# EAGLE design Main (EAGLE 9.6.2)
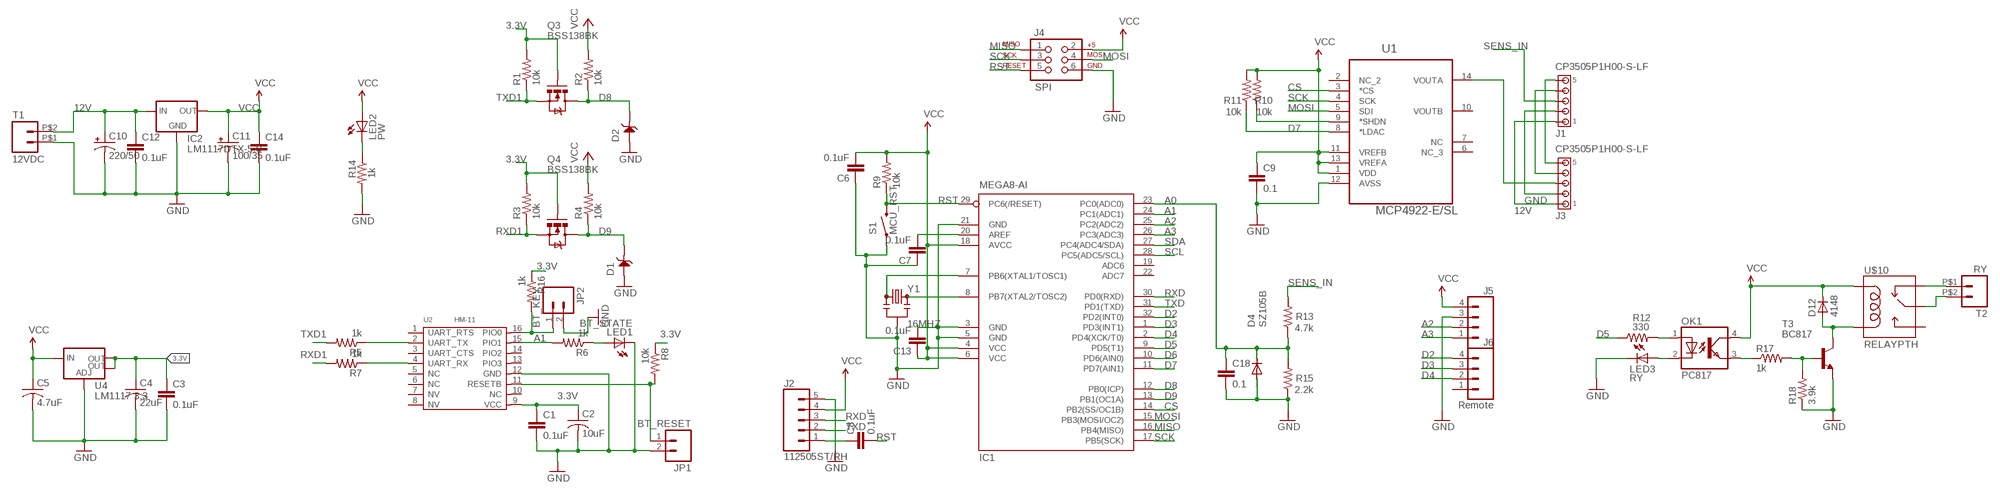
[diagram p0: schematic, sheet 1]

## Parts
C1  0.1uF  CAP0805  [0805]
C2  10uF  C-USC1206  [C1206]
C3  0.1uF  CAP0805  [0805]
C4  22uF  C-USC1206  [C1206]
C5  4.7uF  C-USC1206  [C1206]
C6  0.1uF  CAP0805  [0805]
C7  0.1uF  CAP0805  [0805]
C8  0.1uF  CAP0805  [0805]
C9  0.1  CAP0805  [0805]
C10  220/50  CPOL-US153CLV-1010  [153CLV-1010]
C11  100/35  CPOL-US153CLV-0605  [153CLV-0605]
C12  0.1uF  CAP0805  [0805]
C13  0.1uF  CAP0805  [0805]
C14  0.1uF  CAP0805  [0805]
C18  0.1  CAP0805  [0805]
D1  SMF5.0A  D-ESD-2P'CESD5V0D1'  [SOD123-2.7X1.6]
D2  SMF5.0A  D-ESD-2P'CESD5V0D1'  [SOD123-2.7X1.6]
D4  SZ105B  DIODE-DO-214AC  [DO-214AC]
D12  4148  D-SOD-80  [SOD80]
IC1  MEGA8-AI  [TQFP32-08]
IC2  LM1117DTX-5.0  LM1117DTX-3.3  [TO252]
J1  CP3505P1H00-S-LF  1445055-5  [1445055-5]
J2  112505ST/RH  CONN_05JST  [JST-5-PTH]
J3  CP3505P1H00-S-LF  1445055-5  [1445055-5]
J4  SPI  AVR_SPI_PRG_6PTH  [2X3]
J5  CONN_04JST-PTH  [JST-4-PTH]
J6  Remote  CONN_04JST-PTH  [JST-4-PTH]
JP1  BT_RESET  M02PTH  [1X02]
JP2  BT_KEY  M02PTH  [1X02]
LED1  BT_STATE  LED3MM  [LED3MM]
LED2  PW  LED3MM  [LED3MM]
LED3  RY  LED3MM  [LED3MM]
OK1  PC817  LTV816S  [DIL4-SMD]
Q3  BSS138BK  MOSFET-NCHANNELBSS138  [SOT23-3]
Q4  BSS138BK  MOSFET-NCHANNELBSS138  [SOT23-3]
R1  10k  RESISTOR0805-RES  [0805]
R2  10k  RESISTOR0805-RES  [0805]
R3  10k  RESISTOR0805-RES  [0805]
R4  10k  RESISTOR0805-RES  [0805]
R5  1k  RESISTOR0805-RES  [0805]
R6  1k  RESISTOR0805-RES  [0805]
R7  1k  RESISTOR0805-RES  [0805]
R8  10k  RESISTOR0805-RES  [0805]
R9  10k  RESISTOR0805-RES  [0805]
R10  10k  RESISTOR0805-RES  [0805]
R11  10k  RESISTOR0805-RES  [0805]
R12  330  RESISTOR0805-RES  [0805]
R13  4.7k  RESISTOR0805-RES  [0805]
R14  1k  RESISTOR0805-RES  [0805]
R15  2.2k  RESISTOR0805-RES  [0805]
R16  1k  RESISTOR0805-RES  [0805]
R17  1k  RESISTOR0805-RES  [0805]
R18  3.9k  RESISTOR0805-RES  [0805]
S1  MCU_RST  SWITCH-MOMENTARY-2SMD-1101NE  [TACTILE-SWITCH-1101NE]
T1  12VDC  ST02-3.5MM  [ED350V-02P]
T2  RY  ST02-3.5MM  [ED350V-02P]
T3  BC817  BC817-16-NPN-SOT23-BEC  [SOT23-BEC]
U1  MCP4922-E/SL  [SOIC127P600X175-14N]
U2  HM-11  [16P-18.5X13.5X0.8]
U4  LM1117 3.3  V_REG_LM1117SOT223  [SOT223]
U$10  RELAYPTH  [SRD-05VDC-SL-C]
Y1  16MHZ  RESONATOR16MHZ  [RESONATOR-SMD]

## Nets
3.3V: C1.1 C2.1 C3.1 C4.1 Q3.1(G) Q4.1(G) R1.2 R3.2 R8.1 R16.1 U2.9(VCC) U4.2(OUT) U4.4(OUT)
12V: C10.+ C12.1 IC2.2(IN) J1.1 J3.1 T1.P$2
A0: C18.1 D4.C IC1.23(PC0(ADC0)) R13.1 R15.2
A1: IC1.24(PC1(ADC1)) R6.2 U2.15(PIO1)
A2: IC1.25(PC2(ADC2)) J5.2
A3: IC1.26(PC3(ADC3)) J5.1
CS: IC1.14(PB2(SS/OC1B)) U1.3(*CS)
D2: IC1.32(PD2(INT0)) J6.4
D3: IC1.1(PD3(INT1)) J6.3
D4: IC1.2(PD4(XCK/T0)) J6.2
D5: IC1.9(PD5(T1)) R12.1
D6: IC1.10(PD6(AIN0))
D7: IC1.11(PD7(AIN1)) R11.1 U1.8(*LDAC)
D8: D2.2 IC1.12(PB0(ICP)) Q3.3(D) R2.1
D9: D1.2 IC1.13(PB1(OC1A)) Q4.3(D) R4.1
GND: C1.2 C2.2 C3.2 C4.2 C5.2 C6.1 C7.1 C9.2 C10.- C11.- C12.2 C13.2 C14.2 C18.2 D1.1 D2.1 D4.A IC1.3(GND) IC1.5(GND) IC1.21(GND) IC2.1(GND) J1.2 J2.5 J3.2 J4.6 J5.3 JP1.2 JP2.2 LED1.K(C) LED3.K(C) R14.2 R15.1 R18.1 S1.1 T1.P$1 T3.E U1.12(AVSS) U2.12(GND) U4.1(ADJ) Y1.2
MISO: IC1.16(PB4(MISO)) J4.1
MOSI: IC1.15(PB3(MOSI/OC2)) J4.4 U1.5(SDI)
N$1: LED1.A R6.1
N$2: JP2.1 R16.2 U2.16(PIO0)
N$3: R5.1 U2.2(UART_TX)
N$4: JP1.1 R8.2 U2.11(RESETB)
N$5: IC1.8(PB7(XTAL2/TOSC2)) Y1.3
N$6: R7.1 U2.4(UART_RX)
N$7: IC1.7(PB6(XTAL1/TOSC1)) Y1.1
N$8: C7.2 IC1.20(AREF)
N$9: C8.1 J2.1
N$12: LED2.K(C) R14.1
N$13: J3.3 U1.14(VOUTA)
N$14: J1.5 J3.5
N$15: J1.4 J3.4
N$16: R10.1 U1.9(*SHDN)
N$20: OK1.3(EMIT) R17.1
N$21: R17.2 R18.2 T3.B
N$22: D12.2(A) T3.C U$10.COIL0
N$23: OK1.1(A) R12.2
N$24: T2.P$1 U$10.SWCLOSED(SWCLOSE)
N$25: T2.P$2 U$10.SWCOMMON
N$31: LED3.A OK1.2(C)
RST: C8.2 IC1.29(PC6(/RESET)) J4.5 R9.1 S1.2
RXD: IC1.30(PD0(RXD)) J2.3
RXD1: Q4.2(S) R3.1 R7.2
SCK: IC1.17(PB5(SCK)) J4.3 U1.4(SCK)
SCL: IC1.28(PC5(ADC5/SCL))
SDA: IC1.27(PC4(ADC4/SDA))
SENS_IN: J1.3 R13.2
TXD: IC1.31(PD1(TXD)) J2.2
TXD1: Q3.2(S) R1.1 R5.2
VCC: C5.1 C6.2 C9.1 C11.+ C13.1 C14.1 D12.1(C) IC1.4(VCC) IC1.6(VCC) IC1.18(AVCC) IC2.TAB(OUT) J2.4 J4.2 J5.4 LED2.A OK1.4(COL) R2.2 R4.2 R9.2 R10.2 R11.2 U1.1(VDD) U1.11(VREFB) U1.13(VREFA) U4.3(IN) U$10.COIL1
Unconnected: IC1.19(ADC6) IC1.22(ADC7) J6.1 U1.2(NC_2) U1.6(NC_3) U1.7(NC) U1.10(VOUTB) U2.1(UART_RTS) U2.3(UART_CTS) U2.5(NC) U2.6(NC) U2.7(NV) U2.8(NV) U2.10(NC) U2.13(PIO3) U2.14(PIO2) U$10.SWOPEN

## Library data of the parts
C1 = SparkFun-Capacitors:CAP: Capacitor Standard 0603 ceramic capacitor, and 0.1" leaded capacitor.
C2 C4 C5 = adafruit:C-US: CAPACITOR, American symbol
C3 C6-C9 C12-C14 C18 = SparkFun-Passives:CAP: Capacitor Standard 0603 ceramic capacitor, and 0.1" leaded capacitor.
C10 C11 = adafruit:CPOL-US: POLARIZED CAPACITOR, American symbol
D1 D2 = discrete:D-ESD-2P: Diodes for Protectiong against ESD
D4 = diode:DIODE-: DIODE
D12 = semicon-smd-ipc:D-: DIODE unfilled
IC1 = atmel:MEGA8: MICROCONTROLLER 8 Kbytes FLASH, 1 kbytes SRAM, 512 bytes EEPROM, USART, 6-channel 10 bit ADC, 2-channel 8 bit ADC Pin compatible with Atmega48, ATMega88, ATMega168 Source: avr.lbr; MPN: ATMEGA8-16AU; OC_FARNELL: 9171371; OC_NEWARK: 73M8863
IC2 = lm1117:LM1117DTX-*
J1 J3 = con-amp:1445055-5: Micro MATE-N-LOK Connectors grid 1.5 mm Source: ENG_CD_1445055_A.pdf
J2 = SparkFun-Connectors:CONN_05: Multi connection point. Often used as Generic Header-pin footprint for 0.1 inch spaced/style header connections On any of the 0.1 inch spaced packages, you can populate with these: Break Away Headers - Straight <https://www.sparkfun.com/products/116> (PRT-00116) Break Away Male Headers - Right Angle <https://www.sparkfun.com/products/553> (PRT-00553) Female Headers <https://www.sparkfun.com/products/115> (PRT-00115) Break Away Headers - Machine Pin <https://www.sparkfun.com/products/117> (PRT-00117) Break Away Female Headers - Swiss Machine Pin <https://www.sparkfun.com/products/743> (PRT-00743) For SCREWTERMINALS and SPRING TERMINALS visit here: Screw Terimnals on SparkFun.com <https://www.sparkfun.com/search/results?term=Screw+Terminals> (5mm/3.5mm/2.54mm spacing) This device is also useful as a general connection point to wire up your design to another part of your project. Our various solder wires solder well into these plated through hole pads. Hook-Up Wire - Assortment (Stranded, 22 AWG) <https://www.sparkfun.com/products/11375> (PRT-11375) Hook-Up Wire - Assortment (Solid Core, 22 AWG) <https://www.sparkfun.com/products/11367> (PRT-11367) View the entire wire category on our website here <https://www.sparkfun.com/categories/141> Special notes: Molex polarized connector foot print use with SKU : PRT-08231 with associated crimp pins and housings. 1MM SMD Version SKU: PRT-10208; SF_ID: PRT-09917
J4 = SparkFun-Connectors:AVR_SPI_PRG_6: AVR ISP 6 Pin This is the reduced ISP connector for AVR programming. Common on Arduino. This footprint will take up less PCB space and can be used with a 10-pin to 6-pin adapter such as SKU: BOB-08508 **Special note about "TEST_POINT" package. The stop mask is on the top side, so if you want your programming test points to be on the bottom of your board, make sure to place this package on the bottom side of the board. This also ensure that the orientation to program from the bottom side will be correct.
J5 J6 = SparkFun-Connectors:CONN_04: Multi connection point. Often used as Generic Header-pin footprint for 0.1 inch spaced/style header connections On any of the 0.1 inch spaced packages, you can populate with these: Break Away Headers - Straight <https://www.sparkfun.com/products/116> (PRT-00116) Break Away Male Headers - Right Angle <https://www.sparkfun.com/products/553> (PRT-00553) Female Headers <https://www.sparkfun.com/products/115> (PRT-00115) Break Away Headers - Machine Pin <https://www.sparkfun.com/products/117> (PRT-00117) Break Away Female Headers - Swiss Machine Pin <https://www.sparkfun.com/products/743> (PRT-00743) For SCREWTERMINALS and SPRING TERMINALS visit here: Screw Terimnals on SparkFun.com <https://www.sparkfun.com/search/results?term=Screw+Terminals> (5mm/3.5mm/2.54mm spacing) This device is also useful as a general connection point to wire up your design to another part of your project. Our various solder wires solder well into these plated through hole pads. Hook-Up Wire - Assortment (Stranded, 22 AWG) <https://www.sparkfun.com/products/11375> (PRT-11375) Hook-Up Wire - Assortment (Solid Core, 22 AWG) <https://www.sparkfun.com/products/11367> (PRT-11367) View the entire wire category on our website here <https://www.sparkfun.com/categories/141> Special notes: Molex polarized connector foot print use with SKU : PRT-08231 with associated crimp pins and housings. 1MM SMD Version SKU: PRT-10208; PROD_ID: WIRE-13531; SF_ID: PRT-09916
JP1 JP2 = SparkFun:M02: Header 2 Standard 2-pin 0.1" header. Use with straight break away headers (SKU : PRT-00116), right angle break away headers (PRT-00553), swiss pins (PRT-00743), machine pins (PRT-00117), and female headers (PRT-00115). Molex polarized connector foot print use with SKU : PRT-08233 with associated crimp pins and housings.
LED1-LED3 = adafruit:LED: LED OSRAM: - CHIPLED LG R971, LG N971, LY N971, LG Q971, LY Q971, LO R971, LY R971 LH N974, LH R974 LS Q976, LO Q976, LY Q976 LO Q996 - Hyper CHIPLED LW Q18S LB Q993, LB Q99A, LB R99A - SideLED LS A670, LO A670, LY A670, LG A670, LP A670 LB A673, LV A673, LT A673, LW A673 LH A674 LY A675 LS A676, LA A676, LO A676, LY A676, LW A676 LS A679, LY A679, LG A679 - Hyper Micro SIDELED® LS Y876, LA Y876, LO Y876, LY Y876 LT Y87S - SmartLED LW L88C, LW L88S LB L89C, LB L89S, LG L890 LS L89K, LO L89K, LY L89K LS L896, LA L896, LO L896, LY L896 - TOPLED LS T670, LO T670, LY T670, LG T670, LP T670 LSG T670, LSP T670, LSY T670, LOP T670, LYG T670 LG T671, LOG T671, LSG T671 LB T673, LV T673, LT T673, LW T673 LH T674 LS T676, LA T676, LO T676, LY T676, LB T676, LH T676, LSB T676, LW T676 LB T67C, LV T67C, LT T67C, LS T67K, LO T67K, LY T67K, LW E67C LS E67B, LA E67B, LO E67B, LY E67B, LB E67C, LV E67C, LT E67C LW T67C LS T679, LY T679, LG T679 LS T770, LO T770, LY T770, LG T770, LP T770 LB T773, LV T773, LT T773, LW T773 LH T774 LS E675, LA E675, LY E675, LS T675 LS T776, LA T776, LO T776, LY T776, LB T776 LHGB T686 LT T68C, LB T68C - Hyper Mini TOPLED® LB M676 - Mini TOPLED Santana® LG M470 LS M47K, LO M47K, LY M47K Source: http://www.osram.convergy.de/
OK1 = optocoupler:LTV816: OPTO COUPLER Source: LITEON, LTV816.pdf
Q3 Q4 = SparkFun-DiscreteSemi:MOSFET-NCHANNEL: Common NMOSFET Parts MFG P/N Store ID Prod ID FDD8780 TRANS-09984 SI7820DN TRANS-11055 FDS6630A IC-08089 2N7002PW TRANS-11151 FQP30N06L COM-10213 TRANS-10060 BSS123LT1G TRANS-08345 BSS138 TRANS-00830 BS170 2N7000; PROD_ID: TRANS-00830; VALUE: 200mA/50V
R1-R11 R13-R16 = SparkFun-Resistors:RESISTOR: Resistor Basic schematic elements and footprints for 0603, 1206, and PTH resistors.
R12 R17 R18 = SparkFun-Passives:RESISTOR: Resistor Basic schematic elements and footprints for 0603, 1206, and PTH resistors.
S1 = SparkFun-Electromechanical:SWITCH-MOMENTARY-2: Various NO switches- pushbuttons, reed, etc; PROD_ID: SWCH-00815
T1 T2 = con-dinkle:ST02: Dinkle® Screw Terminal Block - 2 Way -5MM: EK500V series. Rated at 20A, 300VAC. Cable size: 2mm² Supplier: Altronics P2034A Source: http://www.dinkle.com/upfiles/proter21253708953.pdf -5.08MM: The back half of a EK500V4R-04P. Rated at 20A, 300VAC. Cable size: 2mm² Supplier: Altronics P2024 (half of) Source: http://www.dinkle.com/upfiles/proter21253708833.pdf -3.5MM: ED350V series. Rated at 10A, 300VAC. Cable size: 1.4mm² Supplier: Altronics P2028 Source: http://www.dinkle.com/upfiles/proter21253714491.pdf
T3 = transistor:*-NPN-: NPN Transistror BF959 corrected 2008.03.06
U1 = Microchip_By_element14_Batch_1:MCP4922-E/SL: IC, 12BIT DAC DUAL, SPI I/F; MPN: MCP4922-E/SL; OC_FARNELL: 1332114; OC_NEWARK: 08J8748; PACKAGE: SOIC14; SUPPLIER: Microchip
U2 = template:HM-11: Bluetooth Specification V4.0 BLE
U4 = SparkFun-PowerIC:V_REG_LM1117: Voltage Regulator LM1117 Standard adjustable voltage regulator but in SMD form. Spark Fun Electronics SKU : COM-00595; PROD_ID: VREG-08170
U$10 = SRD-05VDC-SL-C:RELAY: SPDT relay (COM-00101)
Y1 = SparkFun-FreqCtrl:RESONATOR: Resonator Small SMD resonator. Used, eg, on the Arduino Pro/ Pro Mini boards. 8MHz- XTAL-08895 16MHz- XTAL-08900; PROD_ID: XTAL-08900

## Net classes
1 power: width 0.203 mm

## Board
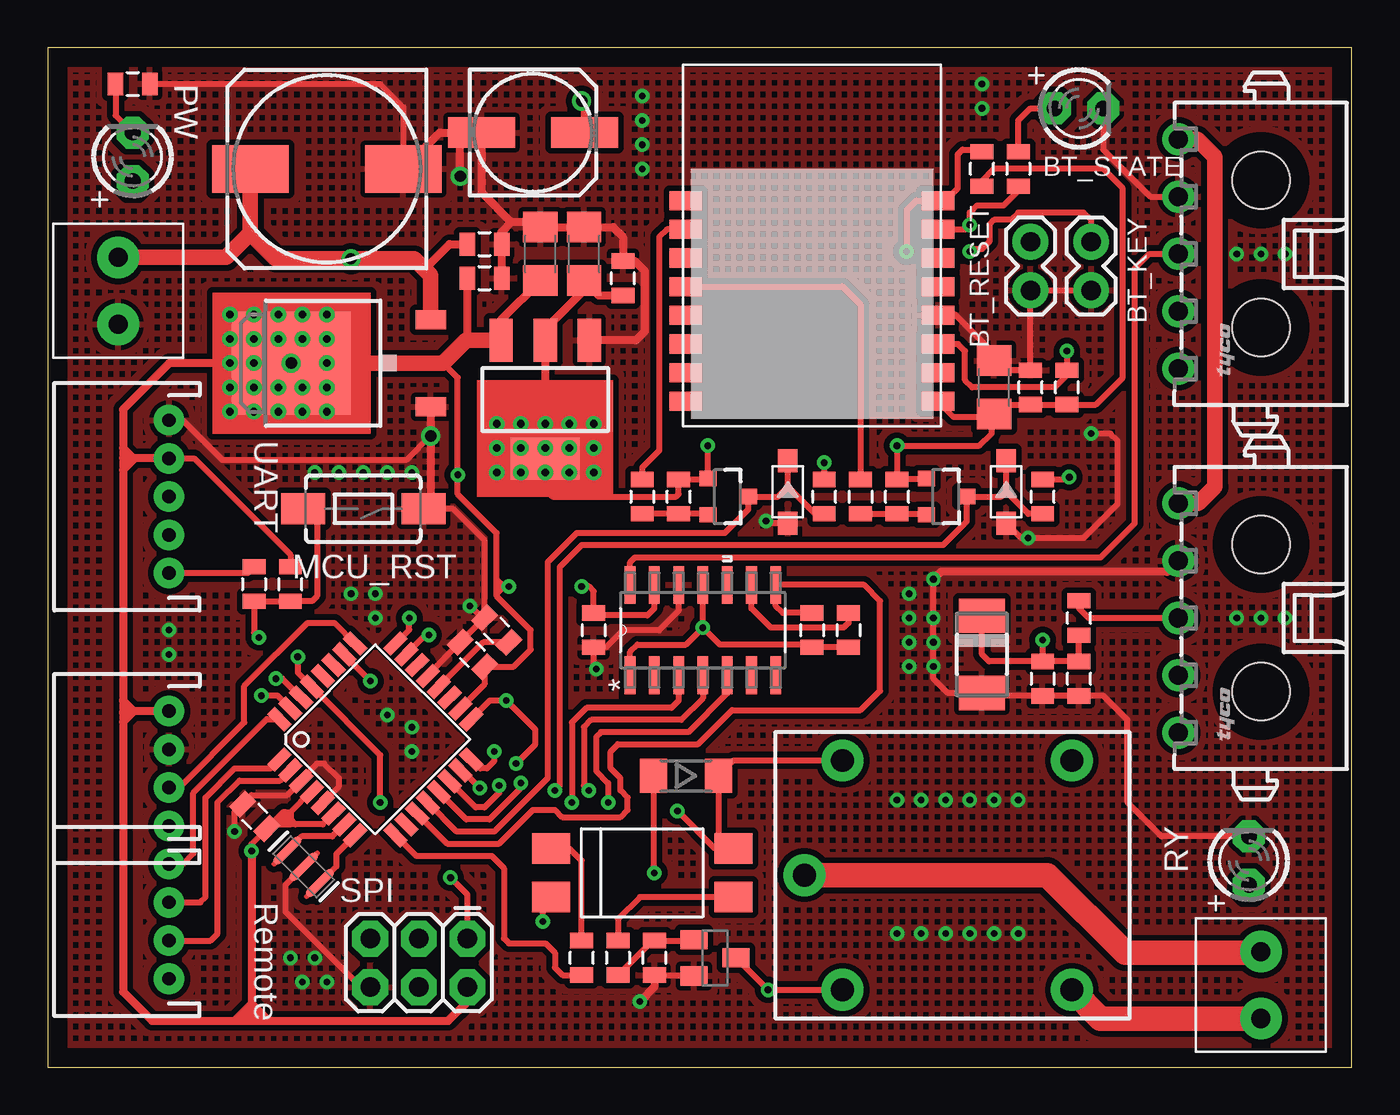
[diagram p1: board, top side]
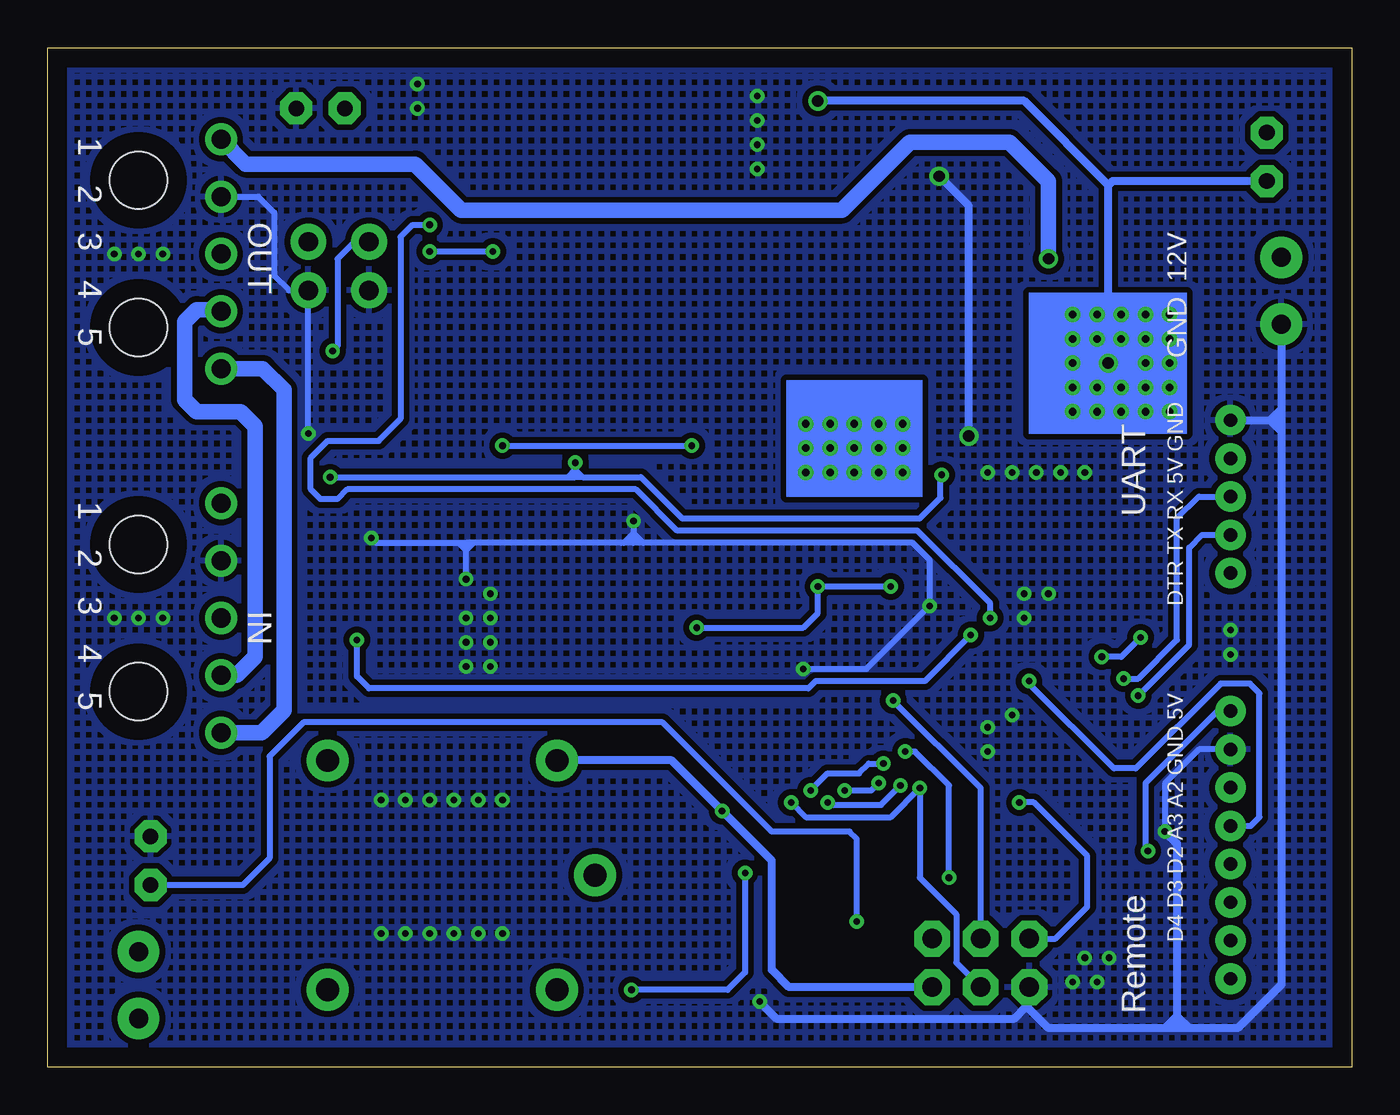
[diagram p2: board, bottom side, seen from below]

Size 68.25 x 53.33 mm. Coordinates in mm from the lower left corner, seen from the top.
Outline: 0,0 68.25,0 68.25,53.33 0,53.33 0,0
Copper layers (1*16): Top 0.035mm / dielectric 1.5mm / Bottom 0.035mm
Design rules "default *": minimum track width 6mil, minimum drill 0.35mm, track to track 6mil, track to pad 6mil, pad to pad 6mil, via to via 6mil, smd to smd 6mil, copper to edge 40mil, drill to drill 6mil, minimum pad ring 10mil, minimum via ring 8mil, stop-mask expansion 4mil, vias tented up to drill 25mil, thermal gap 10mil

### Footprints (pad centres in the part's own frame; a part is rotated, then mirrored left to right if it is on the bottom)
0805 = smd 0.8 x 1.2: 1 -0.9,0; 2 0.9,0
C1206 = smd 1.6 x 1.8: 1 -1.4,0; 2 1.4,0
153CLV-1010 = smd 4 x 2.5: + 4,0; - -4,0
153CLV-0605 = smd 3.5 x 1.6: + 2.7,0; - -2.7,0
SOD123-2.7X1.6 = smd 1.2 x 1.02: 1 -1.635,0; 2 1.635,0
DO-214AC = smd 1.8 x 2.4: A 2.025,0; C -2.025,0
SOD80 = smd 1.4 x 1.8: 1 -1.7,0; 2 1.7,0
TQFP32-08 = smd 1.27 x 0.559: 1 -4.293,2.8; 2 -4.293,2; 3 -4.293,1.2; 4 -4.293,0.4; 5 -4.293,-0.4; 6 -4.293,-1.2; 7 -4.293,-2; 8 -4.293,-2.8; 17 4.293,-2.8; 18 4.293,-2; 19 4.293,-1.2; 20 4.293,-0.4; 21 4.293,0.4; 22 4.293,1.2; 23 4.293,2; 24 4.293,2.8 | smd 0.559 x 1.27: 9 -2.8,-4.293; 10 -2,-4.293; 11 -1.2,-4.293; 12 -0.4,-4.293; 13 0.4,-4.293; 14 1.2,-4.293; 15 2,-4.293; 16 2.8,-4.293; 25 2.8,4.293; 26 2,4.293; 27 1.2,4.293; 28 0.4,4.293; 29 -0.4,4.293; 30 -1.2,4.293; 31 -2,4.293; 32 -2.8,4.293
TO252 = smd 1 x 1.6: 1 -2.28,-4.8; 2 2.28,-4.8 | smd 5.4 x 6.2: TAB 0,2.5
1445055-5 = drill 1 pad 1.676: 1 6,4.32; 2 3,4.32; 3 0,4.32; 4 -3,4.32; 5 -6,4.32 | hole 3: -3.85,0; 3.85,0
JST-5-PTH = drill 0.7 pad 1.6: 1 -4,0; 2 -2,0; 3 0,0; 4 2,0; 5 4,0
2X3 = drill 1.016 pad 1.88 octagon: 1 0,0; 2 0,2.54; 3 2.54,0; 4 2.54,2.54; 5 5.08,0; 6 5.08,2.54
JST-4-PTH = drill 0.7 pad 1.6: 1 -3,0; 2 -1,0; 3 1,0; 4 3,0
1X02 = drill 1.016 pad 1.88: 1 0,0; 2 2.54,0
LED3MM = drill 0.813 pad 1.676 octagon: A -1.27,0; K 1.27,0
DIL4-SMD = smd 1.6 x 2: 1 -1.27,-4.77; 2 1.27,-4.77; 3 1.27,4.77; 4 -1.27,4.77
SOT23-3 = smd 0.8 x 0.9: 1 -0.95,-1; 2 0.95,-1; 3 0,1.1
TACTILE-SWITCH-1101NE = smd 2.3 x 1.6: 1 -3.15,0; 2 3.15,0
ED350V-02P = drill 1 pad 2.184: P$1 0,0; P$2 3.5,0
SOT23-BEC = smd 1 x 1.4: B -0.95,-1.1; C 0,1.1; E 0.95,-1.1
SOIC127P600X175-14N = smd 1.981 x 0.559: 1 -2.362,3.81; 2 -2.362,2.54; 3 -2.362,1.27; 4 -2.362,0; 5 -2.362,-1.27; 6 -2.362,-2.54; 7 -2.362,-3.81; 8 2.362,-3.81; 9 2.362,-2.54; 10 2.362,-1.27; 11 2.362,0; 12 2.362,1.27; 13 2.362,2.54; 14 2.362,3.81
16P-18.5X13.5X0.8 = smd 1.7 x 1: 1 -6.6,2.15; 2 -6.6,0.65; 3 -6.6,-0.85; 4 -6.6,-2.35; 5 -6.6,-3.85; 6 -6.6,-5.35; 7 -6.6,-6.85; 8 -6.6,-8.35; 9 6.6,-8.35; 10 6.6,-6.85; 11 6.6,-5.35; 12 6.6,-3.85; 13 6.6,-2.35; 14 6.6,-0.85; 15 6.6,0.65; 16 6.6,2.15
SOT223 = smd 1.219 x 2.235: 1 -2.311,-3.099; 2 0,-3.099; 3 2.311,-3.099 | smd 3.6 x 2.2: 4 0,3.099
SRD-05VDC-SL-C = drill 1.2 pad 2.184: COIL0 -5.39,-6.12; COIL1 -5.39,5.88; SWCLOSED 6.61,-6.12; SWCOMMON -7.39,-0.12; SWOPEN 6.61,5.88
RESONATOR-SMD = smd 0.45 x 1.905: 1 -1.2,0; 2 0,0; 3 1.2,0

### Placement (x,y rotation side)
C1  51.43,35.56 90 top
C2  49.53,35.56 90 top
C3  30.1,41.27 90 top
C4  28.07,42.55 90 top
C5  25.78,42.55 90 top
C6  22.23,21.59 315 top
C7  23.5,22.86 315 top
C8  10.79,25.27 270 top
C9  28.57,22.86 270 top
C10  14.61,46.99 180 top
C11  25.4,48.9 0 top
C12  22.86,43.05 0 top
C13  10.83,13.12 135 top
C14  22.86,41.27 0 top
C18  52.07,20.32 270 top
D1  50.16,30.1 90 top
D2  38.73,30.1 90 top
D4  48.89,21.59 270 top
D12  33.4,15.24 180 top
IC1  17.14,17.14 45 top
IC2  15.24,36.83 90 top
J1  63.5,23.5 90 top
J2  6.35,29.84 90 top
J3  63.5,42.55 90 top
J4  21.96,6.72 180 top
J5  6.35,15.62 90 top
J6  6.35,7.62 90 top
JP1  51.43,43.18 270 top
JP2  54.61,43.18 270 top
LED1  53.97,50.16 0 top
LED2  4.45,47.62 90 top
LED3  62.87,10.79 90 top
OK1  31.11,10.16 270 top
Q3  35.56,29.84 270 top
Q4  46.99,29.84 270 top
R1  33.02,29.84 90 top
R2  40.64,29.84 90 top
R3  44.45,29.84 90 top
R4  52.07,29.84 90 top
R5  31.11,29.84 270 top
R6  50.8,46.99 270 top
R7  42.54,29.84 270 top
R8  53.34,35.56 90 top
R9  12.7,25.27 90 top
R10  41.91,22.86 270 top
R11  40,22.86 270 top
R12  27.94,5.71 90 top
R13  53.97,23.5 90 top
R14  4.45,51.44 0 top
R15  53.97,20.32 90 top
R16  48.89,46.99 90 top
R17  29.84,5.71 270 top
R18  31.75,5.71 90 top
S1  16.51,29.21 180 top
T1  3.68,38.86 90 top
T2  63.5,2.54 90 top
T3  34.92,5.71 270 top
U1  34.29,22.86 90 top
U2  40,43.18 0 top
U4  26.04,34.92 180 top
U$10  46.99,10.16 0 top
Y1  13.39,10.48 315 top

### Tracks (layer width: path | path; a pad name or v marks a point on that pad's centre or on a via)
3.3V  (via drill 0.35, 0.4)
  Top 0.305: Q4.1 45.94,30.75 R3.2 v44.45,32.51 48.77,32.51 49.4,33.15 49.4,34.02 | U2.9 47.41,34.02 49.4,34.02 | 49.4,34.02 49.66,34.02 C2.1 50.03,34.66 C1.1 R8.1 54.85,34.66 56.26,36.07 56.26,45.97 55.24,46.99 49.53,46.99 48.89,46.35 R16.1 | v34.54,32.51 34.56,32.5 Q3.1 34.51,30.75 R1.2 33.02,29.97 32.89,29.84 26.42,29.84 26.04,30.23 v26.04,31.11 U4.4 | v23.5,33.66 v24.77,33.66 25.4,33.66 26.04,34.29 26.67,33.66 v27.3,33.66 | v27.3,33.66 v28.57,33.66 v28.57,32.38 v27.3,32.38 26.59,32.38 U4.4 | U4.4 25.48,32.38 v24.77,32.38 v23.5,32.38 v23.5,31.11 v24.77,31.11 25.32,31.11 U4.4 | v28.57,31.11 v27.3,31.11 26.75,31.11 26.71,31.15 U4.4 | v26.04,33.66 v27.3,33.66
  Top 0.406: C3.1 28.84,40.38 C4.1 28.07,40.64 26.04,38.61 U4.2 26.04,34.29 v26.04,33.66 v26.04,32.38 U4.4
  Bottom 0.305: v44.45,32.51 v34.54,32.51
12V  (via drill 0.6)
  Top 0.406: 19.72,41.74 21.03,43.05 C12.1
  Top 0.813: T1.P$2 9.34,42.36 10.61,43.62 | C10.+ 10.61,43.62 | 10.61,43.62 11.94,42.29 v15.88,42.29 19.18,42.29 19.72,41.74 20.04,41.43 IC2.2 | J1.1 60.23,29.5 61.09,30.35 61.09,47.62 60.17,48.55 J3.1
  Bottom 0.813: J3.1 57.88,47.24 49.02,47.24 46.61,44.83 26.67,44.83 23.11,48.39 17.91,48.39 15.88,46.35 v15.88,42.29
A0  (via drill 0.35)
  Top 0.305: R13.1 R15.2 C18.1 | C18.1 49.26,21.22 48.89,21.59 D4.C | IC1.23 19.78,22.61 v19.94,22.61 | v52.07,22.35 C18.1
  Bottom 0.305: v19.94,22.61 22.35,20.19 28.07,20.19 28.45,19.81 51.43,19.81 52.07,20.45 v52.07,22.35
A1  (via drill 0.35)
  Top 0.305: U2.15 48.02,43.83 v48.26,44.07 48.26,44.7 48.64,45.09 50.04,45.09 50.8,45.85 R6.2 | IC1.24 18.92,22.88 v18.92,23.5
  Bottom 0.305: v18.92,23.5 18.92,24.26 22.73,28.07 35.31,28.07 37.46,30.23 52.58,30.23 53.09,29.72 53.97,29.72 54.48,30.23 54.48,31.88 53.59,32.77 50.93,32.77 49.78,33.91 49.78,43.43 49.15,44.07 v48.26,44.07
A2
  Top 0.305: J5.2 6.87,14.62 10.29,18.03 10.29,19.94 13.59,23.24 15.01,23.24 IC1.25
A3  (via drill 0.35)
  Top 0.305: v16.89,20.19 15.52,21.56 IC1.26
  Bottom 0.305: J5.1 5.29,12.62 4.83,13.08 4.83,19.56 5.33,20.07 6.86,20.07 11.3,15.62 12.45,15.62 16.89,20.07 v16.89,20.19
CS  (via drill 0.35)
  Top 0.305: U1.3 33.02,19.18 32.64,18.8 28.19,18.8 27.43,18.03 v27.43,13.84 | v23.62,14.73 23.62,14.35 22.86,13.59 22.4,13.59 IC1.14
  Bottom 0.305: v27.43,13.84 27.3,13.72 24.64,13.72 v23.62,14.73
D2
  Top 0.305: J6.4 7.06,10.62 7.62,11.18 7.62,14.35 11.47,18.2 IC1.32
D3
  Top 0.305: J6.3 7.99,8.62 8.26,8.89 8.26,14.1 9.78,15.62 11.66,15.62 IC1.1
D4
  Top 0.305: J6.2 8.53,6.62 8.89,6.99 8.89,13.84 10.03,14.99 12.16,14.99 IC1.2
D5
  Top 0.305: IC1.9 19.28,11.05 23.24,11.05 23.88,10.41 23.88,6.73 24.14,6.47 26.05,6.47 26.54,5.97 26.54,5.21 26.93,4.82 R12.1
D7
  Top 0.305: R11.1 38.47,23.76 38.1,24.13 U1.8 42.72,25.22 43.56,24.38 43.56,19.68 42.54,18.67 35.81,18.67 34.04,16.89 29.84,16.89 29.46,16.51 29.46,15.62 29.97,15.11 29.97,14.48 30.35,14.1 30.35,13.46 29.97,13.08 26.92,13.08 26.54,13.46 25.4,13.46 23.62,11.68 20.91,11.68 IC1.11
D8
  Top 0.305: 38.73,30.35 D2.2 | 38.73,30.35 38.23,29.84 Q3.3 36.66,29.17 35.43,27.94 27.69,27.94 26.16,26.42 26.16,15.11 23.37,12.32 21.41,12.32 IC1.12 | R2.1 40.14,28.95 38.73,30.35
D9  (via drill 0.35)
  Top 0.305: 50.16,30.1 49.91,29.84 Q4.3 48.09,28.53 46.86,27.3 27.94,27.3 26.8,26.16 26.8,14.73 v26.54,14.48 | 50.16,30.1 D1.2 | R4.1 51.32,28.95 50.16,30.1 | v24.77,14.86 24.77,14.61 23.11,12.95 21.9,12.95 IC1.13
  Bottom 0.305: v26.54,14.48 25.15,14.48 v24.77,14.86
GND  (via drill 0.35, 0.6)
  Top 0.305: R18.1 33.77,4.82 T3.E | U2.12 46.64,39.37 47.5,39.37 49.53,37.34 C2.2 50.03,36.46 C1.2 JP1.2 JP2.2 | C7.1 C6.1 19.9,20.54 IC1.21 | IC1.5 15.24,14.67 15.24,15.11 14.48,15.88 14.1,15.88 13.26,15.04 IC1.3 12.53,14.22 10.67,14.22 C13.2 9.78,13.34 v9.78,12.32 | J4.6 16.39,4.18 12.45,8.13 12.45,9.53 Y1.2 | U1.12 33.02,23.88 31.99,22.85 30.1,22.85 29.21,21.96 C9.2 28.57,20.95 v28.7,20.83 | v20.04,33.02 18.77,31.75 9.14,31.75 7.05,33.84 J2.5 | C7.1 22.86,27.56 21.21,29.21 S1.1 | R14.2 17.4,51.44 18.61,50.23 C10.- | LED3.K 58.29,12.06 56.51,13.84 56.51,18.16 55.26,19.42 R15.1 C18.2 49.04,19.42 D4.A 47.11,19.57 46.35,20.32 v46.35,25.53 | v22.1,24.13 22.73,23.5 C7.1 | D1.1 50.94,27.69 v51.31,27.69 54.23,27.69 56.01,29.46 56.01,32.77 55.63,33.15 v54.61,33.15 | D2.1 37.7,28.46 v37.59,28.57 | LED1.K 55.24,48.01 57.71,45.55 J3.2
  Top 0.406: C14.2 C12.2 23.75,43.06 23.75,43.69 24.26,44.2 | 24.26,44.2 25.53,44.2 C5.2 C4.2 29.59,43.95 30.1,43.43 C3.2 30.72,42.17 31.24,41.66 31.24,38.48 30.79,38.02 U4.1 | C10.- 20.51,48.9 21.59,48.9 | 21.59,48.9 C11.- 22.7,45.76 24.26,44.2 | S1.1 20.04,29.59 v20.04,33.02 IC2.1 | v21.59,46.61 21.59,48.9 | R18.1 31.75,4.19 v30.99,3.43 | J1.2 58.59,25.91 46.74,25.91 v46.35,25.53
  Bottom 0.305: J3.2 57.23,45.55 56.39,44.7 56.39,41.4 55.63,40.64 JP2.2 v54.61,33.15 | LED1.K 55.5,49.91 | J5.3 8,16.62 9.78,14.84 v9.78,12.32 | v28.7,20.83 25.4,20.83 v22.1,24.13 22.1,26.54 22.99,27.43 37.08,27.43 | 37.08,27.43 37.59,27.43 | 37.59,27.43 38.1,27.43 | 45.97,27.43 38.23,27.43 38.1,27.43 | 45.97,27.43 46.35,27.43 | v51.31,27.69 51.05,27.43 46.74,27.43 | 46.74,27.43 46.35,27.43 | v37.59,28.57 37.59,27.94 | 37.59,27.94 37.59,27.43 | v46.35,25.53 46.35,27.05 | 46.35,27.05 46.35,27.43 | 45.97,27.43 46.35,27.05 | 46.35,27.05 46.74,27.43 | 37.59,27.94 37.08,27.43 | 37.59,27.94 38.1,27.43
  Bottom 0.406: v20.04,33.02 20.04,45.06 v21.59,46.61 | T1.P$1 3.68,34.42 | 3.68,34.42 3.68,33.78 | 3.68,33.78 3.68,33.27 | 3.68,33.27 3.68,4.32 5.97,2.03 8.51,2.03 | 8.51,2.03 9.02,2.03 | 9.02,2.03 9.78,2.03 | 9.78,2.03 15.88,2.03 17.02,3.17 | 17.02,3.17 17.02,4.05 J4.6 | v30.99,3.43 30.1,2.54 17.65,2.54 17.02,3.17 | v9.78,12.32 9.14,11.68 9.14,2.67 | 9.02,2.03 9.14,2.16 9.14,2.67 | 9.14,2.67 8.51,2.03 | 9.78,2.03 9.14,2.67 | J2.5 4.26,33.84 | 4.26,33.84 3.75,33.84 3.68,33.78 | 4.26,33.84 3.68,34.42 | 3.68,33.27 4.26,33.84
  other vias: 45.08,24.77 45.08,23.5 45.08,22.23 45.08,20.95 46.35,20.95 46.35,22.23 46.35,23.5 13.97,31.11 15.24,31.11 16.51,31.11 17.78,31.11 19.05,31.11 31.11,50.8 31.11,49.53 31.11,48.26 31.11,46.99 48.89,51.44 48.89,50.16 17.78,18.41 19.05,17.78 19.05,16.51 6.35,22.86 6.35,21.59 12.7,5.71 13.34,4.45 14.61,4.45 13.97,5.71 44.45,13.97 45.72,13.97 46.99,13.97 48.26,13.97 49.53,13.97 50.8,13.97 50.8,6.99 49.53,6.99 48.26,6.99 46.99,6.99 45.72,6.99 44.45,6.99 62.23,23.5 63.5,23.5 64.77,23.5 63.5,42.55 64.77,42.55 62.23,42.55 15.88,24.77 17.14,24.77 17.14,23.5
  pour Top (isolate 0.305, hatched): 0.13,53.34 68.33,53.34 68.33,0 0.13,0
  pour Bottom (isolate 0.305, hatched): 0,53.21 68.33,53.21 68.33,0 0,0
MISO  (via drill 0.35)
  Top 0.305: J4.1 21.96,9.03 v21.08,9.91 | v23.37,16.51 23.37,16 22.99,15.62 22.63,15.62 IC1.16
  Bottom 0.305: v21.08,9.91 21.08,14.73 22.86,16.51 v23.37,16.51
MOSI  (via drill 0.35)
  Top 0.305: U1.5 35.56,19.56 33.53,17.53 28.96,17.53 28.7,17.27 28.7,15.49 29.34,14.86 v29.34,13.84 | v22.61,14.61 21.69,15.52 IC1.15
  Bottom 0.305: v29.34,13.84 28.57,13.08 24.13,13.08 v22.61,14.61 22.61,9.91 20.7,8 20.7,5.46 J4.4
N$1
  Top 0.305: R6.1 50.8,49.53 51.43,50.16 LED1.A
N$2  (via drill 0.35)
  Top 0.305: R16.2 48.78,48.01 47.88,48.01 47.62,47.75 47.62,45.97 46.98,45.33 U2.16 46.6,45.34 45.47,45.34 44.96,44.83 v44.96,42.67 | JP2.1 54.61,44.32 54.23,44.7 50.8,44.7 50.42,44.32 49.53,44.32 49.28,44.07 49.28,43.18 48.89,42.8 48.26,42.8 v48.26,42.67
  Bottom 0.305: v48.26,42.67 v44.96,42.67
N$3
  Top 0.305: U2.2 32.4,43.83 32,43.43 32,32.26 31.11,31.37 R5.1
N$4  (via drill 0.35)
  Top 0.305: U2.11 47.64,37.83 48.01,37.47 48.01,35.94 48.39,35.56 52.7,35.56 53.34,36.2 R8.2 v53.34,37.47
  Bottom 0.305: JP1.1 52.2,43.18 53.09,42.29 53.09,37.72 v53.34,37.47
N$5
  Top 0.305: Y1.3 15.11,10.5 15.11,11.15 IC1.8
N$6
  Top 0.305: U2.4 41.59,40.83 42.54,39.88 R7.1
N$7
  Top 0.305: IC1.7 14.89,12.06 13.28,12.06 Y1.1
N$8
  Top 0.305: C7.2 22.79,22.22 IC1.20
N$9
  Top 0.305: C8.1 10.47,25.84 J2.1
N$12
  Top 0.305: R14.1 3.55,49.8 LED2.K
N$13
  Top 0.305: U1.14 30.48,26.42 30.73,26.67 55.12,26.67 56.9,28.45 56.9,41.78 57.66,42.55 J3.3
N$14
  Bottom 0.813: J1.5 57.05,17.5 55.88,18.67 55.88,35.43 56.99,36.55 J3.5
N$15
  Bottom 0.813: J1.4 58.37,20.5 57.4,21.46 57.4,33.53 58.17,34.29 60.45,34.29 61.09,34.92 61.09,38.99 60.45,39.62 59.26,39.62 J3.4
N$16
  Top 0.305: R10.1 41.91,23.24 41.66,22.99 37.85,22.99 36.83,24 U1.9
N$20
  Top 0.305: OK1.3 30.99,8.89 29.84,7.75 R17.1
N$21
  Top 0.305: R17.2 31.64,6.62 R18.2 33.77,6.62 T3.B
N$22  (via drill 0.35)
  Top 0.305: T3.C v37.7,4.04 U$10.COIL0 | D12.2 31.7,10.21 v31.75,10.16
  Bottom 0.305: v31.75,10.16 31.75,4.95 32.66,4.04 v37.7,4.04
N$23
  Top 0.305: R12.2 27.94,10.79 27.3,11.43 OK1.1
N$24
  Top 1.27: U$10.SWCLOSED 55.1,2.54 T2.P$1
N$25
  Top 1.27: U$10.SWCOMMON 52.32,10.04 56.39,5.97 63.43,5.97 T2.P$2
N$31  (via drill 0.35)
  Top 0.305: OK1.2 25.91,8.45 v25.91,7.62
  Bottom 0.305: v25.91,7.62 25.91,11.94 26.29,12.32 30.35,12.32 36.07,18.03 54.86,18.03 56.64,16.26 56.64,10.92 58.04,9.53 LED3.A
RST  (via drill 0.35)
  Top 0.305: S1.2 14.1,28.47 14.1,24.64 13.83,24.37 R9.1 C8.2 10.79,22.73 v11.05,22.48 | v13.08,21.46 13.08,20.64 IC1.29 17.4,16.32 v17.4,13.84
  Bottom 0.305: v11.05,22.48 12.07,21.46 v13.08,21.46 | J4.5 15.5,6.72 13.84,8.38 13.84,11.05 16.64,13.84 v17.4,13.84
RXD  (via drill 0.35)
  Top 0.305: IC1.30 12.27,20.32 v11.94,20.32
  Bottom 0.305: v11.94,20.32 11.18,20.32 9.14,22.35 9.14,28.7 8,29.84 J2.3
RXD1
  Top 0.305: R7.2 R3.1 45.94,28.95 Q4.2
SCK  (via drill 0.35)
  Top 0.305: U1.4 34.29,19.3 33.15,18.16 28.45,18.16 28.07,17.78 28.07,14.73 v28.32,14.48 | v24.51,15.88 25.53,16.89 25.53,17.65 v24,19.18 23.14,19.18 IC1.17
  Bottom 0.305: v28.32,14.48 27.43,15.37 25.78,15.37 25.27,15.88 v24.51,15.88 | J4.3 19.42,14.6 v24,19.18
SENS_IN
  Top 0.305: J1.3 54.48,23.5 53.97,24 R13.2
TXD  (via drill 0.35)
  Top 0.305: IC1.31 12.03,19.43 v11.18,19.43
  Bottom 0.305: v11.18,19.43 8.51,22.1 8.51,27.18 7.84,27.84 J2.2
TXD1
  Top 0.305: Q3.2 34.51,28.95 R1.1 R5.2
VCC  (via drill 0.35, 0.4, 0.6)
  Top 0.305: R10.2 R11.2 39.87,22.1 35.18,22.1 v34.29,22.99 | IC1.18 22.86,20.03 C6.2 24.38,20.95 25.27,21.84 25.27,22.86 23.5,24.64 23.5,24.77 | U$10.COIL1 35.9,16.04 D12.1 35.1,12.21 OK1.4 34.92,11.43 v32.96,13.4 | C13.1 11.69,12.7 12.19,12.7 | IC1.6 14.4,12.7 12.95,12.7 | 12.19,12.7 12.7,12.7 | 12.95,12.7 12.7,12.7 | C13.1 12.19,13.21 | 12.19,13.21 12.32,13.34 12.45,13.34 | 12.45,13.34 12.7,13.34 | IC1.4 13.76,14.39 12.7,13.34 | 12.7,13.34 12.7,12.95 | 12.7,12.95 12.7,12.7 | 12.7,12.7 12.45,12.95 12.45,13.34 | 12.19,13.21 12.19,12.7 | 12.95,12.7 12.7,12.95 | v10.67,11.3 10.67,11.68 C13.1 | U1.13 31.75,24 31.38,23.63 28.7,23.63 C9.1 28.57,24.89 28.32,25.15 v27.94,25.15 | 20.7,36.83 21.46,36.07 v21.46,30.99 21.46,29.97 23.5,27.94 23.5,25.53 | 23.5,24.77 23.5,25.15 | 23.5,25.15 23.5,25.53 | v34.29,22.99 U1.11 | U1.1 30.48,21.72 30.86,22.1 33.4,22.1 v34.29,22.99 | J2.4 7.65,31.84 12.7,26.8 R9.2 | 10.67,2.92 10.67,2.41 | 11.56,2.41 11.18,2.41 10.67,2.92 | 10.16,2.41 10.67,2.92 | R4.2 53.35,30.75 v53.47,30.86 | R2.2 v40.64,31.62 | 23.5,25.15 v24.13,25.15 23.88,25.15 | 23.88,25.15 23.5,25.53 | 23.88,25.15 23.5,24.77 | v9.53,39.37 v9.53,38.1 v9.53,36.83 v9.53,35.56 v9.53,34.29 v10.79,34.29 12.74,36.23 IC2.TAB | IC2.TAB 11.47,35.56 v10.79,35.56 | 12.07,36.83 v10.79,38.1 11.47,38.1 | IC2.TAB 12.74,34.88 v13.34,34.29 v13.34,35.56 | IC2.TAB 12.74,36.16 v13.34,35.56 | IC2.TAB 12.07,36.16 v12.07,35.56 v12.07,34.29 12.74,34.97 IC2.TAB | IC2.TAB 12.07,37.51 | 12.07,37.51 v12.07,38.1 v12.07,39.37 12.74,38.7 IC2.TAB | 12.07,37.51 11.47,38.1 | 11.47,38.1 10.79,38.77 v10.79,39.37 | IC2.TAB 13.34,36.23 v13.34,35.56 | IC2.TAB 15.24,36.83
  Top 0.305: IC2.TAB 14.61,38.7 v14.61,39.37 v13.34,38.1 | IC2.TAB 13.34,37.42 v13.34,38.1 | IC2.TAB 12.74,37.51 v13.34,38.1 | IC2.TAB 14.01,35.56 v14.61,35.56 | IC2.TAB 13.34,36.83 v14.61,38.1 | IC2.TAB 14.61,34.97 v14.61,34.29 | IC2.TAB 12.74,38.77 v13.34,39.37
  Top 0.406: C14.1 21.96,38.09 21.89,38.02 | C5.1 23.72,39.09 U4.3 | v27.94,50.55 28.1,50.39 C11.+ | IC2.TAB 12.07,36.83 v10.79,36.83 v9.53,36.83 6.35,36.83 3.94,34.42 3.94,32.38 | 3.94,32.38 3.94,31.88 | 3.94,31.88 3.94,31.24 | 3.94,31.24 3.94,19.18 | 3.94,19.18 3.94,18.54 | 3.94,18.54 3.94,18.06 | 3.94,18.06 3.94,3.94 5.46,2.41 9.78,2.41 | J4.2 21.96,3.42 20.96,2.41 11.56,2.41 | 9.78,2.41 10.16,2.41 10.67,2.41 11.56,2.41 | v10.67,11.3 10.67,3.3 | 10.67,3.3 10.67,2.92 | J5.4 4.49,18.62 | 4.49,18.62 4.02,18.62 3.94,18.54 | 4.49,18.62 3.94,19.18 | 3.94,18.06 4.49,18.62 | 10.67,3.3 9.78,2.41 | 10.67,3.3 11.56,2.41 | J2.4 4.48,31.84 | 4.48,31.84 3.97,31.84 3.94,31.88 | 4.48,31.84 3.94,32.38 | 4.48,31.84 4.48,31.78 3.94,31.24
  Top 0.813: IC2.TAB v14.61,36.83 15.24,36.83 20.7,36.83 21.89,38.02 U4.3
  Bottom 0.305: J5.4 7.03,18.62 10.79,14.86 10.79,11.43 v10.67,11.3 | v53.47,30.86 41.02,30.86 | 41.02,30.86 40.64,30.86 | 40.26,30.86 40.64,30.86 | 21.59,30.86 21.53,30.92 | 21.53,30.92 v21.46,30.99 | 40.64,30.86 v40.64,31.62 40.64,31.24 | 40.64,31.24 40.26,30.86 | 40.64,31.24 41.02,30.86 | v24.13,25.15 v27.94,25.15 27.94,23.75 28.7,22.99 v34.29,22.99 | 21.53,30.92 21.53,29.78 22.61,28.7 35.05,28.7 37.21,30.86 40.26,30.86
  Bottom 0.406: IC2.TAB 12.74,46.14 | v27.94,50.55 17.14,50.55 12.74,46.14 | J4.2 29.46,4.18 30.35,5.08 30.35,10.79 v32.96,13.4 35.6,16.04 U$10.COIL1 | LED2.A 12.53,46.35 12.74,46.14
  other vias: 12.74,36.83
(copper drawn outside any net)
  shapes: Bottom area x2, Top area x2

### Text on the board
tNames: UART | RY | Remote
bNames: 1 2 3 4 5 | GND 12V | OUT | DTR TX RX 5V GND | 1 2 3 4 5 | UART | IN | D4 D3 D2 A3 A2 GND 5V